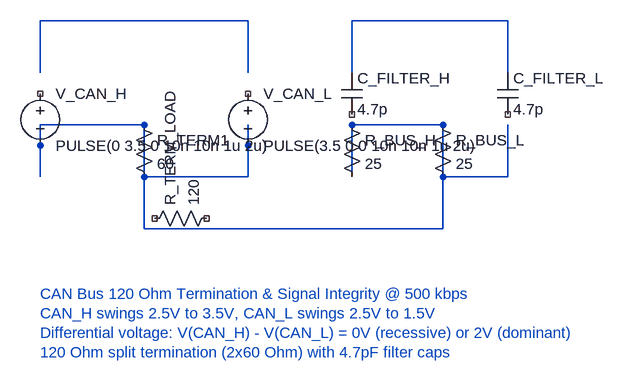
[diagram p0: schematic can_bus_termination.asc]
can_bus_termination.asc, the LTspice schematic file:
Version 4
SHEET 1 2000 1200
WIRE 80 160 80 80
WIRE 80 80 400 80
WIRE 400 80 400 160
WIRE 80 320 80 240
WIRE 400 320 400 240
WIRE 80 240 240 240
WIRE 240 240 240 320
WIRE 240 320 400 320
WIRE 240 320 240 400
WIRE 560 160 560 80
WIRE 560 80 800 80
WIRE 800 80 800 160
WIRE 560 320 560 240
WIRE 800 320 800 240
WIRE 560 240 700 240
WIRE 700 240 700 320
WIRE 700 320 800 320
WIRE 700 320 700 400
WIRE 240 400 700 400
SYMBOL voltage 80 176 R0
SYMATTR InstName V_CAN_H
SYMATTR Value PULSE(0 3.5 0 10n 10n 1u 2u)
SYMBOL res 224 224 R0
SYMATTR InstName R_TERM1
SYMATTR Value 60
SYMBOL voltage 400 176 R0
SYMATTR InstName V_CAN_L
SYMATTR Value PULSE(3.5 0 0 10n 10n 1u 2u)
SYMBOL res 240 400 R270
SYMATTR InstName R_TERM_LOAD
SYMATTR Value 120
SYMBOL cap 544 160 R0
SYMATTR InstName C_FILTER_H
SYMATTR Value 4.7p
SYMBOL cap 784 160 R0
SYMATTR InstName C_FILTER_L
SYMATTR Value 4.7p
SYMBOL res 544 224 R0
SYMATTR InstName R_BUS_H
SYMATTR Value 25
SYMBOL res 684 224 R0
SYMATTR InstName R_BUS_L
SYMATTR Value 25
TEXT 80 500 Left 2 ;CAN Bus 120 Ohm Termination & Signal Integrity @ 500 kbps
TEXT 80 530 Left 2 ;CAN_H swings 2.5V to 3.5V, CAN_L swings 2.5V to 1.5V
TEXT 80 560 Left 2 ;Differential voltage: V(CAN_H) - V(CAN_L) = 0V (recessive) or 2V (dominant)
TEXT 80 590 Left 2 ;120 Ohm split termination (2x60 Ohm) with 4.7pF filter caps
.tran 0 20u 0 2n
.backanno
.end

The netlist it stands for:
* can_bus_termination.asc
V_CAN_H NC_01 N002 PULSE(0 3.5 0 10n 10n 1u 2u)
R_TERM1 N002 N002 60
V_CAN_L NC_02 N002 PULSE(3.5 0 0 10n 10n 1u 2u)
R_TERM_LOAD NC_03 NC_04 120
C_FILTER_H N003 NC_05 4.7p
C_FILTER_L N003 NC_06 4.7p
R_BUS_H N002 N002 25
R_BUS_L N002 N002 25
* CAN Bus 120 Ohm Termination & Signal Integrity @ 500 kbps
* CAN_H swings 2.5V to 3.5V, CAN_L swings 2.5V to 1.5V
* Differential voltage: V(CAN_H) - V(CAN_L) = 0V (recessive) or 2V (dominant)
* 120 Ohm split termination (2x60 Ohm) with 4.7pF filter caps
.backanno
.end